# EAGLE design hirose_omnetics_adapter_schematic_rev5 (EAGLE 7.2.0)
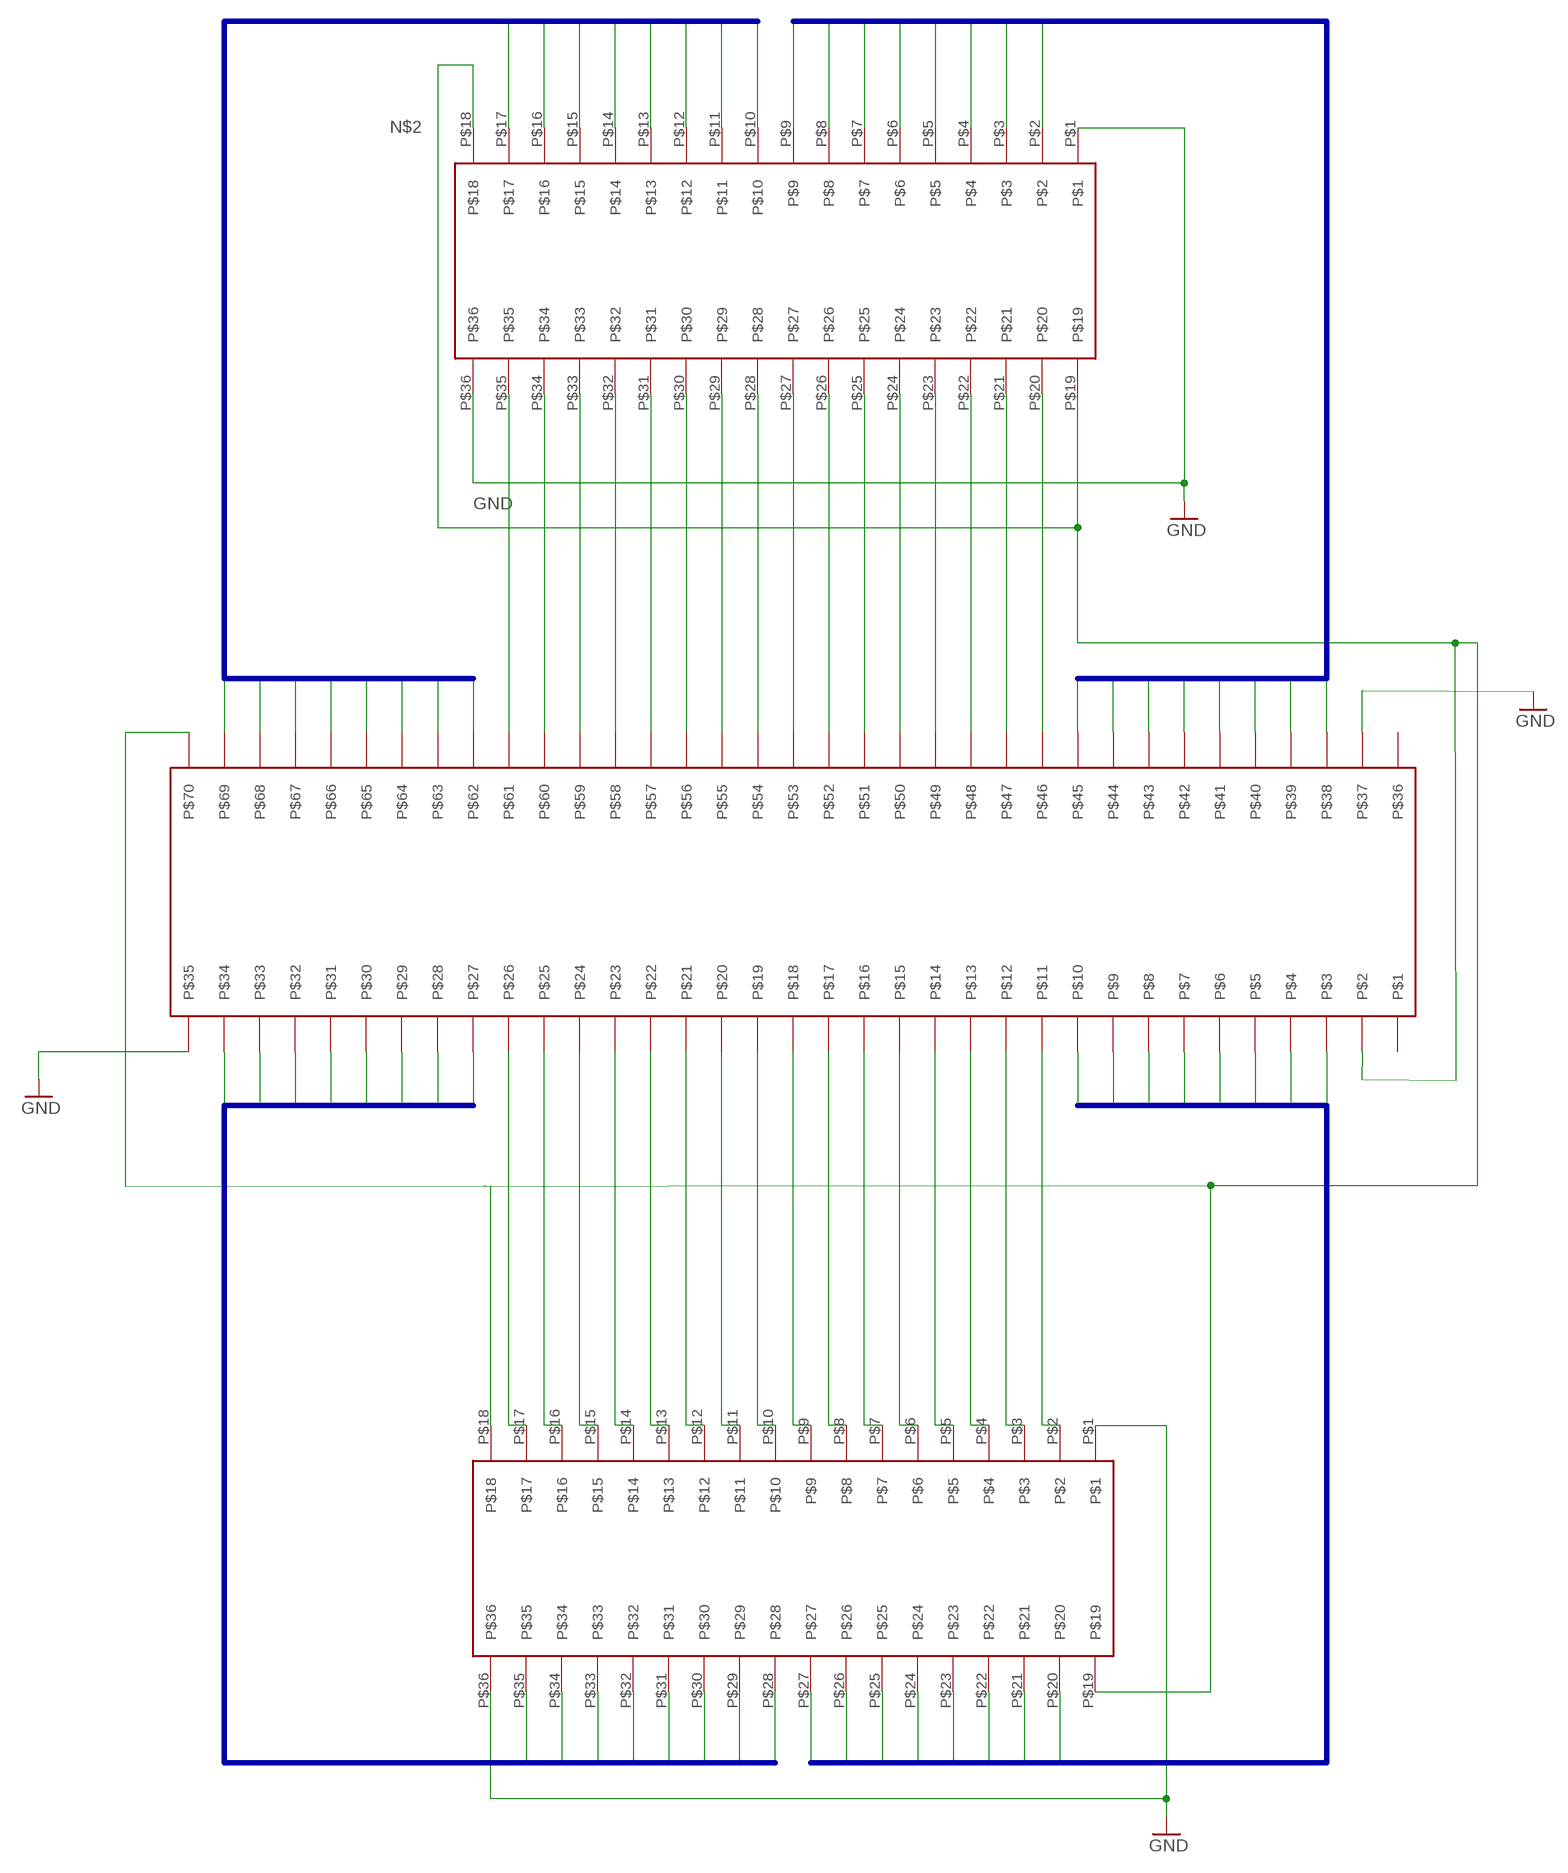
[diagram p0: schematic, sheet 1]

## Parts
U$1  HIROSE_DF40_70PIN  [HIROSE_DF40C-70DS]
U$2  OMNETICS_A79026  [OMNETICS_A79026-001]
U$3  OMNETICS_A79026  [OMNETICS_A79026-001]

## Nets
A0: U$1.P$69 U$2.P$10
A1: U$1.P$68 U$2.P$11
A2: U$1.P$67 U$2.P$12
A3: U$1.P$66 U$2.P$13
A4: U$1.P$65 U$2.P$14
A5: U$1.P$64 U$2.P$15
A6: U$1.P$63 U$2.P$16
A7: U$1.P$62 U$2.P$17
B0: U$1.P$38 U$2.P$9
B1: U$1.P$39 U$2.P$8
B2: U$1.P$40 U$2.P$7
B3: U$1.P$41 U$2.P$6
B4: U$1.P$42 U$2.P$5
B5: U$1.P$43 U$2.P$4
B6: U$1.P$44 U$2.P$3
B7: U$1.P$45 U$2.P$2
C0: U$1.P$34 U$3.P$28
C1: U$1.P$33 U$3.P$29
C2: U$1.P$32 U$3.P$30
C3: U$1.P$31 U$3.P$31
C4: U$1.P$30 U$3.P$32
C5: U$1.P$29 U$3.P$33
C6: U$1.P$28 U$3.P$34
C7: U$1.P$27 U$3.P$35
D0: U$1.P$3 U$3.P$27
D1: U$1.P$4 U$3.P$26
D2: U$1.P$5 U$3.P$25
D3: U$1.P$6 U$3.P$24
D4: U$1.P$7 U$3.P$23
D5: U$1.P$8 U$3.P$22
D6: U$1.P$9 U$3.P$21
D7: U$1.P$10 U$3.P$20
GND: U$1.P$35 U$1.P$37 U$2.P$1 U$2.P$36 U$3.P$1 U$3.P$36
N$1: U$1.P$61 U$2.P$35
N$2: U$1.P$2 U$1.P$70 U$2.P$18 U$2.P$19 U$3.P$18 U$3.P$19
N$3: U$1.P$60 U$2.P$34
N$4: U$1.P$59 U$2.P$33
N$5: U$1.P$58 U$2.P$32
N$6: U$1.P$57 U$2.P$31
N$7: U$1.P$56 U$2.P$30
N$8: U$1.P$55 U$2.P$29
N$9: U$1.P$54 U$2.P$28
N$10: U$1.P$53 U$2.P$27
N$11: U$1.P$52 U$2.P$26
N$12: U$1.P$51 U$2.P$25
N$13: U$1.P$50 U$2.P$24
N$14: U$1.P$49 U$2.P$23
N$15: U$1.P$48 U$2.P$22
N$16: U$1.P$47 U$2.P$21
N$17: U$1.P$46 U$2.P$20
N$18: U$1.P$26 U$3.P$17
N$19: U$1.P$25 U$3.P$16
N$20: U$1.P$24 U$3.P$15
N$21: U$1.P$23 U$3.P$14
N$22: U$1.P$22 U$3.P$13
N$23: U$1.P$21 U$3.P$12
N$24: U$1.P$20 U$3.P$11
N$25: U$1.P$19 U$3.P$10
N$26: U$1.P$18 U$3.P$9
N$27: U$1.P$17 U$3.P$8
N$28: U$1.P$16 U$3.P$7
N$29: U$1.P$15 U$3.P$6
N$30: U$1.P$14 U$3.P$5
N$31: U$1.P$13 U$3.P$4
N$32: U$1.P$12 U$3.P$3
N$33: U$1.P$11 U$3.P$2
Unconnected: U$1.P$1 U$1.P$36

## Buses
A[0..7]
B[0..7]
C[0..7]
D[0..7]

## Library data of the parts
U$1 = GG_hirose70:HIROSE_DF40_70PIN
U$2 U$3 = Omnetics_A79026-001:OMNETICS_A79026

## Board
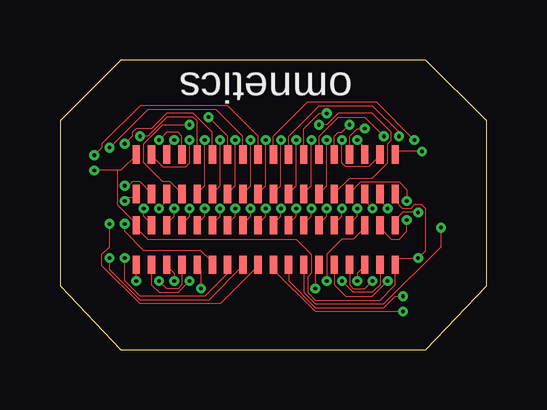
[diagram p1: board, top side]
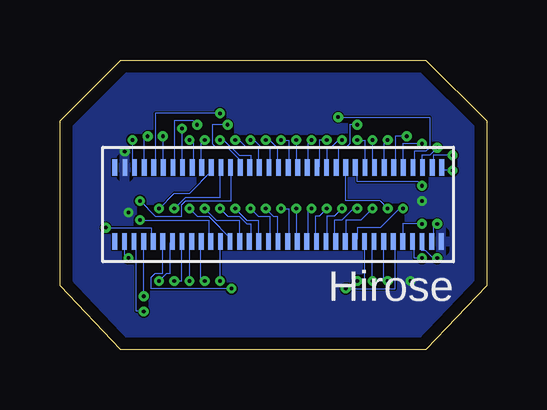
[diagram p2: board, bottom side, seen from below]

Size 17.78 x 12.06 mm. Coordinates in mm from the lower left corner, seen from the top.
Outline: 2.54,0 15.24,0 17.78,2.67 17.78,9.52 15.24,12.06 2.54,12.06 0,9.52 0,2.67 2.54,0
Copper layers (1*16): Top 0.035mm / dielectric 1.5mm / Bottom 0.035mm
Design rules "RHD64ch_amp_designrules": minimum track width 2mil, minimum drill 6mil, track to track 2mil, track to pad 2mil, pad to pad 2mil, via to via 2mil, smd to smd 2mil, copper to edge 20mil, drill to drill 15mil, minimum pad ring 5mil, minimum via ring 5mil, stop-mask expansion 2mil, vias tented up to drill 0mil, thermal gap 10mil

### Footprints (pad centres in the part's own frame; a part is rotated, then mirrored left to right if it is on the bottom)
HIROSE_DF40C-70DS = smd 0.2 x 0.7: P$1 0,0; P$2 -0.4,0; P$3 -0.8,0; P$4 -1.2,0; P$5 -1.6,0; P$6 -2,0; P$7 -2.4,0; P$8 -2.8,0; P$9 -3.2,0; P$10 -3.6,0; P$11 -4,0; P$12 -4.4,0; P$13 -4.8,0; P$14 -5.2,0; P$15 -5.6,0; P$16 -6,0; P$17 -6.4,0; P$18 -6.8,0; P$19 -7.2,0; P$20 -7.6,0; P$21 -8,0; P$22 -8.4,0; P$23 -8.8,0; P$24 -9.2,0; P$25 -9.6,0; P$26 -10,0; P$27 -10.4,0; P$28 -10.8,0; P$29 -11.2,0; P$30 -11.6,0; P$31 -12,0; P$32 -12.4,0; P$33 -12.8,0; P$34 -13.2,0; P$35 -13.6,0; P$36 0,-3.08; P$37 -0.42,-3.08; P$38 -0.82,-3.08; P$39 -1.22,-3.08; P$40 -1.62,-3.08; P$41 -2.02,-3.08; P$42 -2.42,-3.08; P$43 -2.82,-3.08; P$44 -3.22,-3.08; P$45 -3.62,-3.08; P$46 -4.02,-3.08; P$47 -4.42,-3.08; P$48 -4.82,-3.08; P$49 -5.22,-3.08; P$50 -5.62,-3.08; P$51 -6.02,-3.08; P$52 -6.42,-3.08; P$53 -6.82,-3.08; P$54 -7.22,-3.08; P$55 -7.62,-3.08; P$56 -8.02,-3.08; P$57 -8.42,-3.08; P$58 -8.82,-3.08; P$59 -9.22,-3.08; P$60 -9.62,-3.08; P$61 -10.02,-3.08; P$62 -10.42,-3.08; P$63 -10.82,-3.08; P$64 -11.22,-3.08; P$65 -11.62,-3.08; P$66 -12.02,-3.08; P$67 -12.42,-3.08; P$68 -12.82,-3.08; P$69 -13.22,-3.08; P$70 -13.62,-3.08
OMNETICS_A79026-001 = smd 0.305 x 0.762: P$1 0,0; P$2 -0.635,0; P$3 -1.27,0; P$4 -1.905,0; P$5 -2.54,0; P$6 -3.175,0; P$7 -3.81,0; P$8 -4.445,0; P$9 -5.08,0; P$10 -5.715,0; P$11 -6.35,0; P$12 -6.985,0; P$13 -7.62,0; P$14 -8.255,0; P$15 -8.89,0; P$16 -9.525,0; P$17 -10.16,0; P$18 -10.795,0; P$19 0,-1.651; P$20 -0.635,-1.651; P$21 -1.27,-1.651; P$22 -1.905,-1.651; P$23 -2.54,-1.651; P$24 -3.175,-1.651; P$25 -3.81,-1.651; P$26 -4.445,-1.651; P$27 -5.08,-1.651; P$28 -5.715,-1.651; P$29 -6.35,-1.651; P$30 -6.985,-1.651; P$31 -7.62,-1.651; P$32 -8.255,-1.651; P$33 -8.89,-1.651; P$34 -9.525,-1.651; P$35 -10.16,-1.651; P$36 -10.795,-1.651

### Placement (x,y rotation side)
U$1  15.49,4.5 180 bottom
U$2  13.97,8.13 0 top
U$3  13.97,5.18 0 top

### Tracks (layer width: path | path; a pad name or v marks a point on that pad's centre or on a via)
A0  (via drill 0.15)
  Top 0.051: v1.43,8.1 1.75,8.41 1.75,8.57 3.33,10.16 6.98,10.16 8.26,8.89 U$2.P$10
  Bottom 0.051: v1.43,8.1 2.22,8.1 2.22,7.62 U$1.P$69
A1  (via drill 0.15)
  Top 0.051: v2.06,8.41 3.65,10 6.51,10 7.62,8.89 U$2.P$11
  Bottom 0.051: v2.06,8.41 2.38,8.1 2.7,8.1 2.7,7.62 U$1.P$68
A2  (via drill 0.15)
  Top 0.051: v6.19,9.68 6.98,8.89 U$2.P$12
  Bottom 0.051: v6.19,9.68 2.38,9.68 2.38,8.41 2.54,8.26 3.02,8.26 3.02,7.62 U$1.P$67
A3  (via drill 0.15)
  Top 0.051: v2.7,8.57 3.02,8.89 3.02,9.05 3.17,9.21 3.81,9.21 4.45,9.84 5.56,9.84 6.35,9.05 U$2.P$13
  Bottom 0.051: v2.7,8.57 3.49,8.57 3.49,7.62 U$1.P$66
A4  (via drill 0.15)
  Top 0.051: v3.33,8.89 3.65,8.89 4.45,9.68 5.56,9.68 5.71,9.52 U$2.P$14
  Bottom 0.051: v3.33,8.89 3.81,8.89 3.81,7.62 U$1.P$65
A5  (via drill 0.15)
  Top 0.051: v4.13,8.73 4.45,9.05 4.92,9.05 5.08,8.89 U$2.P$15
  Bottom 0.051: v4.13,8.73 4.29,8.73 4.29,7.62 U$1.P$64
A6  (via drill 0.15)
  Top 0.051: v4.76,8.73 4.45,8.41 U$2.P$16
  Bottom 0.051: v4.76,8.73 4.76,7.62 U$1.P$63
A7  (via drill 0.15)
  Top 0.051: v5.4,8.73 5.4,7.78 5.24,7.62 4.29,7.62 3.81,8.1 U$2.P$17
  Bottom 0.051: v5.4,8.73 5.08,8.73 5.08,7.62 U$1.P$62
B0  (via drill 0.15)
  Top 0.051: v14.76,8.73 13.18,10.32 10.32,10.32 8.89,8.89 U$2.P$9
  Bottom 0.051: v14.76,8.73 14.76,7.62 U$1.P$38
B1  (via drill 0.15)
  Top 0.051: v14.13,8.89 14.13,9.05 13.02,10.16 10.8,10.16 9.52,8.89 U$2.P$8
  Bottom 0.051: v14.13,8.89 14.29,8.89 14.29,7.62 U$1.P$39
B2  (via drill 0.15)
  Top 0.051: v11.11,9.84 10.8,9.84 10.16,9.21 U$2.P$7
  Bottom 0.051: v11.11,9.84 13.81,9.84 13.81,7.62 U$1.P$40
B3  (via drill 0.15)
  Top 0.051: v13.49,8.89 12.7,9.68 11.59,9.68 10.8,8.89 U$2.P$6
  Bottom 0.051: v13.49,8.89 13.49,7.62 U$1.P$41
B4  (via drill 0.15)
  Top 0.051: v12.06,9.37 11.75,9.05 11.59,9.05 11.43,8.89 U$2.P$5
  Bottom 0.051: v12.06,9.37 12.22,9.52 13.02,9.52 13.02,7.62 U$1.P$42
B5  (via drill 0.15)
  Top 0.051: v12.7,9.21 12.38,9.21 12.06,8.89 U$2.P$4
  Bottom 0.051: v12.7,9.21 12.7,7.62 U$1.P$43
B6  (via drill 0.15)
  Top 0.051: v12.38,8.73 12.7,8.41 U$2.P$3
  Bottom 0.051: v12.38,8.73 12.22,8.73 12.22,7.62 U$1.P$44
B7  (via drill 0.15)
  Top 0.051: v11.75,8.73 11.75,7.78 11.91,7.62 12.86,7.62 13.34,8.1 U$2.P$2
  Bottom 0.051: v11.75,8.73 11.91,8.73 11.91,7.62 U$1.P$45
C0  (via drill 0.15)
  Top 0.051: v2.06,5.24 2.06,4.29 1.75,3.97 1.75,3.49 3.33,1.91 6.67,1.91 8.26,3.49 U$3.P$28
  Bottom 0.051: v2.06,5.24 2.22,5.24 2.22,4.6 U$1.P$34
C1  (via drill 0.15)
  Top 0.051: v2.06,3.81 2.06,3.33 3.33,2.06 6.19,2.06 7.62,3.49 U$3.P$29
  Bottom 0.051: v2.06,3.81 2.22,3.81 2.54,4.13 2.7,4.13 2.7,4.45 U$1.P$33
C2  (via drill 0.15)
  Top 0.051: v2.7,3.81 2.7,2.86 3.33,2.22 6.03,2.22 6.98,3.17 U$3.P$30
  Bottom 0.051: v2.7,3.81 3.02,3.81 3.02,4.45 U$1.P$32
C3  (via drill 0.15)
  Top 0.051: v2.7,5.24 2.7,4.92 3.49,4.13 5.87,4.13 6.35,3.65 U$3.P$31
  Bottom 0.051: v2.7,5.24 3.49,5.24 3.49,4.6 U$1.P$31
C4  (via drill 0.15)
  Top 0.051: v5.87,2.54 5.87,3.33 5.71,3.49 U$3.P$32
  Bottom 0.051: v5.87,2.54 3.81,2.54 3.81,4.45 U$1.P$30
C5  (via drill 0.15)
  Top 0.051: v4.13,2.86 4.45,2.54 4.92,2.54 5.08,2.7 U$3.P$33
  Bottom 0.051: v4.13,2.86 4.29,2.86 4.29,4.45 U$1.P$29
C6  (via drill 0.15)
  Top 0.051: v4.76,2.86 4.76,3.17 4.45,3.49 U$3.P$34
  Bottom 0.051: v4.76,2.86 4.76,4.45 U$1.P$28
C7  (via drill 0.15)
  Top 0.051: v5.4,2.86 4.92,2.38 4.13,2.38 3.81,2.7 U$3.P$35
  Bottom 0.051: v5.4,2.86 5.08,2.86 5.08,4.45 U$1.P$27
D0  (via drill 0.15)
  Top 0.051: v14.29,1.59 10.64,1.59 8.89,3.33 U$3.P$27
  Bottom 0.051: v14.29,1.59 14.6,1.59 14.6,4.45 U$1.P$3
D1  (via drill 0.15)
  Top 0.051: v14.29,2.22 13.97,2.22 13.49,1.75 10.64,1.75 9.52,2.86 U$3.P$26
  Bottom 0.051: v14.29,2.22 14.29,4.45 U$1.P$4
D2  (via drill 0.15)
  Top 0.051: v15.88,5.08 15.88,4.29 13.49,1.91 10.64,1.91 10.16,2.38 U$3.P$25
  Bottom 0.051: v15.88,5.08 13.97,5.08 13.97,4.6 U$1.P$5
D3  (via drill 0.15)
  Top 0.051: v10.64,2.54 10.64,3.33 10.8,3.49 U$3.P$24
  Bottom 0.051: v10.64,2.54 13.97,2.54 13.97,3.02 13.81,3.17 13.49,3.17 13.49,4.45 U$1.P$6
D4  (via drill 0.15)
  Top 0.051: v13.65,2.86 13.02,2.22 11.91,2.22 11.43,2.7 U$3.P$23
  Bottom 0.051: v13.65,2.86 13.34,3.17 13.18,3.17 13.18,4.45 U$1.P$7
D5  (via drill 0.15)
  Top 0.051: v13.02,2.86 12.7,2.54 12.22,2.54 12.06,2.7 U$3.P$22
  Bottom 0.051: v13.02,2.86 12.7,2.86 12.7,4.45 U$1.P$8
D6  (via drill 0.15)
  Top 0.051: v12.38,2.86 12.38,3.17 12.7,3.49 U$3.P$21
  Bottom 0.051: v12.38,2.86 12.38,4.45 U$1.P$9
D7  (via drill 0.15)
  Top 0.051: v11.75,2.86 12.22,2.38 13.02,2.38 13.34,2.7 U$3.P$20
  Bottom 0.051: v11.75,2.86 11.91,2.86 11.91,4.45 U$1.P$10
GND  (via drill 0.15)
  Top 0.051: v3.17,2.86 U$3.P$36 | v2.7,6.19 2.86,6.35 3.17,6.35 U$2.P$36 | U$3.P$1 13.97,5.4 14.29,5.72 v14.92,5.72 | v15.08,8.26 13.97,8.26 U$2.P$1
  Bottom 0.051: v15.08,8.26 15.23,8.39
  pour Bottom: -1.02,12.32 17.78,12.32 17.78,-0.13 -1.02,-0.13
N$1  (via drill 0.15)
  Top 0.051: v2.7,6.83 2.86,6.83 3.02,6.98 3.33,6.98 3.81,6.51 U$2.P$35
  Bottom 0.051: v2.7,6.83 2.86,6.98 5.4,6.98 5.4,7.46 U$1.P$61
N$2  (via drill 0.15)
  Top 0.051: U$2.P$19 13.97,6.19 14.29,5.87 14.6,5.87 14.76,6.03 15.08,6.03 15.24,5.87 15.24,4.13 v14.92,3.81 14.13,3.81 13.97,3.65 U$3.P$19 13.97,2.7 13.34,2.06 10.64,2.06 10.32,2.38 10.32,3.02 10.48,3.17 10.48,3.97 9.84,4.6 3.65,4.6 3.17,5.08 U$3.P$18 3.17,5.24 2.38,6.03 2.38,7.46 | 2.38,7.46 2.54,7.46 3.17,8.1 U$2.P$18 | 2.38,7.46 v1.43,7.46
  Bottom 0.051: v14.92,3.81 15.08,3.81 15.08,4.45 U$1.P$2 | v1.43,7.46 1.91,7.46 U$1.P$70
N$3  (via drill 0.15)
  Top 0.051: v4.13,5.87 4.45,6.19 U$2.P$34
  Bottom 0.051: v4.13,5.87 4.45,6.19 5.87,6.19 5.87,7.46 U$1.P$60
N$4  (via drill 0.15)
  Top 0.051: v5.4,9.37 4.29,9.37 3.49,8.57 3.49,7.78 4.29,6.98 4.6,6.98 5.08,6.51 U$2.P$33
  Bottom 0.051: v5.4,9.37 5.71,9.37 5.71,8.57 5.87,8.41 6.19,8.41 6.19,7.62 U$1.P$59
N$5  (via drill 0.15)
  Top 0.051: v6.03,8.73 6.03,6.83 5.71,6.51 U$2.P$32
  Bottom 0.051: v6.03,8.73 6.19,8.73 6.51,8.41 6.67,8.41 6.67,7.62 U$1.P$58
N$6  (via drill 0.15)
  Top 0.051: v6.67,8.73 6.67,6.83 6.35,6.51 U$2.P$31
  Bottom 0.051: v6.67,8.73 6.98,8.73 6.98,7.62 U$1.P$57
N$7  (via drill 0.15)
  Top 0.051: v7.3,8.73 7.3,6.83 6.98,6.51 U$2.P$30
  Bottom 0.051: v7.3,8.73 7.46,8.73 7.46,7.62 U$1.P$56
N$8  (via drill 0.15)
  Top 0.051: v7.94,8.73 7.94,6.83 7.62,6.51 U$2.P$29
  Bottom 0.051: v7.94,8.73 7.94,7.62 U$1.P$55
N$9  (via drill 0.15)
  Top 0.051: v8.57,8.73 8.57,6.83 8.26,6.51 U$2.P$28
  Bottom 0.051: v8.57,8.73 8.26,8.73 8.26,7.62 U$1.P$54
N$10  (via drill 0.15)
  Top 0.051: v9.21,8.73 9.21,6.83 8.89,6.51 U$2.P$27
  Bottom 0.051: v9.21,8.73 9.05,8.73 8.73,8.41 8.73,7.62 U$1.P$53
N$11  (via drill 0.15)
  Top 0.051: v9.84,8.73 9.84,6.83 9.52,6.51 U$2.P$26
  Bottom 0.051: v9.84,8.73 9.68,8.73 9.37,8.41 9.05,8.41 9.05,7.62 U$1.P$52
N$12  (via drill 0.15)
  Top 0.051: v10.48,8.73 10.48,6.83 10.16,6.51 U$2.P$25
  Bottom 0.051: v10.48,8.73 10.32,8.73 10,8.41 9.52,8.41 9.52,7.62 U$1.P$51
N$13  (via drill 0.15)
  Top 0.051: v11.11,8.73 11.11,6.83 10.8,6.51 U$2.P$24
  Bottom 0.051: v11.11,8.73 10.95,8.73 10.32,8.1 9.84,8.1 9.84,7.62 U$1.P$50
N$14  (via drill 0.15)
  Top 0.051: v10.8,9.37 11.11,9.37 11.59,9.84 13.02,9.84 13.81,9.05 13.81,8.73 13.65,8.57 13.65,7.78 13.02,7.14 12.06,7.14 11.43,6.51 U$2.P$23
  Bottom 0.051: v10.8,9.37 11.43,9.37 11.43,8.57 11.27,8.41 10.8,8.41 10.32,7.94 10.32,7.62 U$1.P$49
N$15  (via drill 0.15)
  Top 0.051: v14.45,6.19 14.45,6.67 14.13,6.98 12.54,6.98 12.06,6.51 U$2.P$22
  Bottom 0.051: v14.45,6.19 13.81,5.56 12.7,5.56 12.7,6.03 12.54,6.19 10.64,6.19 10.64,7.46 U$1.P$48
N$16  (via drill 0.15)
  Top 0.051: v13.02,5.87 12.7,6.19 U$2.P$21
  Bottom 0.051: v13.02,5.87 12.54,6.35 11.11,6.35 11.11,7.46 U$1.P$47
N$17  (via drill 0.15)
  Top 0.051: v13.65,5.87 13.34,6.19 U$2.P$20
  Bottom 0.051: v13.65,5.87 13.02,6.51 12.38,6.51 11.43,7.46 U$1.P$46
N$18  (via drill 0.15)
  Top 0.051: v3.49,5.87 3.49,5.56 3.81,5.24 U$3.P$17
  Bottom 0.051: v3.49,5.87 3.65,5.87 4.45,5.08 5.4,5.08 5.4,4.6 U$1.P$26
N$19  (via drill 0.15)
  Top 0.051: v4.76,5.87 4.76,5.56 4.45,5.24 U$3.P$16
  Bottom 0.051: v4.76,5.87 5.24,5.4 5.87,5.4 5.87,4.6 U$1.P$25
N$20  (via drill 0.15)
  Top 0.051: v5.4,5.87 5.4,5.56 5.08,5.24 U$3.P$15
  Bottom 0.051: v5.4,5.87 5.56,5.87 6.03,5.4 6.35,5.4 6.35,4.6 U$1.P$24
N$21  (via drill 0.15)
  Top 0.051: v6.03,5.87 6.03,5.56 5.71,5.24 U$3.P$14
  Bottom 0.051: v6.03,5.87 6.35,5.56 6.67,5.56 6.67,4.6 U$1.P$23
N$22  (via drill 0.15)
  Top 0.051: v6.67,5.87 6.67,5.56 6.35,5.24 U$3.P$13
  Bottom 0.051: v6.67,5.87 6.98,5.56 7.14,5.56 7.14,4.6 U$1.P$22
N$23  (via drill 0.15)
  Top 0.051: v7.3,5.87 7.3,5.56 6.98,5.24 U$3.P$12
  Bottom 0.051: v7.3,5.87 7.46,5.87 7.46,4.6 U$1.P$21
N$24  (via drill 0.15)
  Top 0.051: v7.94,5.87 7.94,5.56 7.62,5.24 U$3.P$11
  Bottom 0.051: v7.94,5.87 7.94,4.6 U$1.P$20
N$25  (via drill 0.15)
  Top 0.051: v8.57,5.87 8.57,5.56 8.26,5.24 U$3.P$10
  Bottom 0.051: v8.57,5.87 8.26,5.87 8.26,4.6 U$1.P$19
N$26  (via drill 0.15)
  Top 0.051: v9.21,5.87 9.21,5.56 8.89,5.24 U$3.P$9
  Bottom 0.051: v9.21,5.87 8.89,5.56 8.73,5.56 8.73,4.6 U$1.P$18
N$27  (via drill 0.15)
  Top 0.051: v9.84,5.87 9.84,5.56 9.52,5.24 U$3.P$8
  Bottom 0.051: v9.84,5.87 9.52,5.56 9.05,5.56 9.05,4.6 U$1.P$17
N$28  (via drill 0.15)
  Top 0.051: v10.48,5.87 10.48,5.56 10.16,5.24 U$3.P$7
  Bottom 0.051: v10.48,5.87 10,5.4 9.52,5.4 9.52,4.6 U$1.P$16
N$29  (via drill 0.15)
  Top 0.051: v11.11,5.87 11.11,5.56 10.8,5.24 U$3.P$6
  Bottom 0.051: v11.11,5.87 10.8,5.56 10.32,5.56 10,5.24 9.84,5.24 9.84,4.6 U$1.P$15
N$30  (via drill 0.15)
  Top 0.051: v11.75,5.87 11.75,5.56 11.43,5.24 U$3.P$5
  Bottom 0.051: v11.75,5.87 11.27,5.4 10.32,5.4 10.32,4.6 U$1.P$14
N$31  (via drill 0.15)
  Top 0.051: v12.38,5.87 12.38,5.56 12.06,5.24 U$3.P$4
  Bottom 0.051: v12.38,5.87 12.06,5.56 11.59,5.56 10.64,4.6 U$1.P$13
N$32  (via drill 0.15)
  Top 0.051: v11.11,2.86 11.11,3.97 11.75,4.6 12.22,4.6 12.7,5.08 U$3.P$3
  Bottom 0.051: v11.11,2.86 11.11,4.45 U$1.P$12
N$33  (via drill 0.15)
  Top 0.051: v14.45,5.4 14.45,4.92 14.13,4.6 13.81,4.6 13.34,5.08 U$3.P$2
  Bottom 0.051: v14.45,5.4 11.59,5.4 11.59,4.6 U$1.P$11

### Text on the board
tNames: omnetics